# EAGLE schematic decoupling (EAGLE 7.6.0)
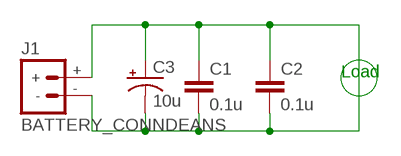
[diagram p0: schematic, sheet 1]

## Parts
C1  0.1u  CAPPTH  [CAP-PTH-SMALL]
C2  0.1u  CAPPTH  [CAP-PTH-SMALL]
C3  10u  CAP_POLPTH2  [CPOL-RADIAL-10UF-25V]
J1  BATTERY_CONNDEANS  [DEANS]

## Nets
N$1: C1.1 C1.2 C2.1 C2.2 C3.1(+) C3.2(-) J1.+ J1.-

## Notes on the sheet
- Load

## Library data of the parts
C1 C2 = SparkFun-Capacitors:CAP: Capacitor Standard 0603 ceramic capacitor, and 0.1" leaded capacitor.
C3 = SparkFun-Capacitors:CAP_POL: Capacitor Polarized These are standard SMD and PTH capacitors. Normally 10uF, 47uF, and 100uF in electrolytic and tantalum varieties. Always verify the external diameter of the through hole cap, it varies with capacity, voltage, and manufacturer. The EIA devices should be standard.
J1 = SparkFun-Connectors:BATTERY_CONN: Various footprints for battery connectors